# EAGLE design mainControllerRev3 (EAGLE 5.11)
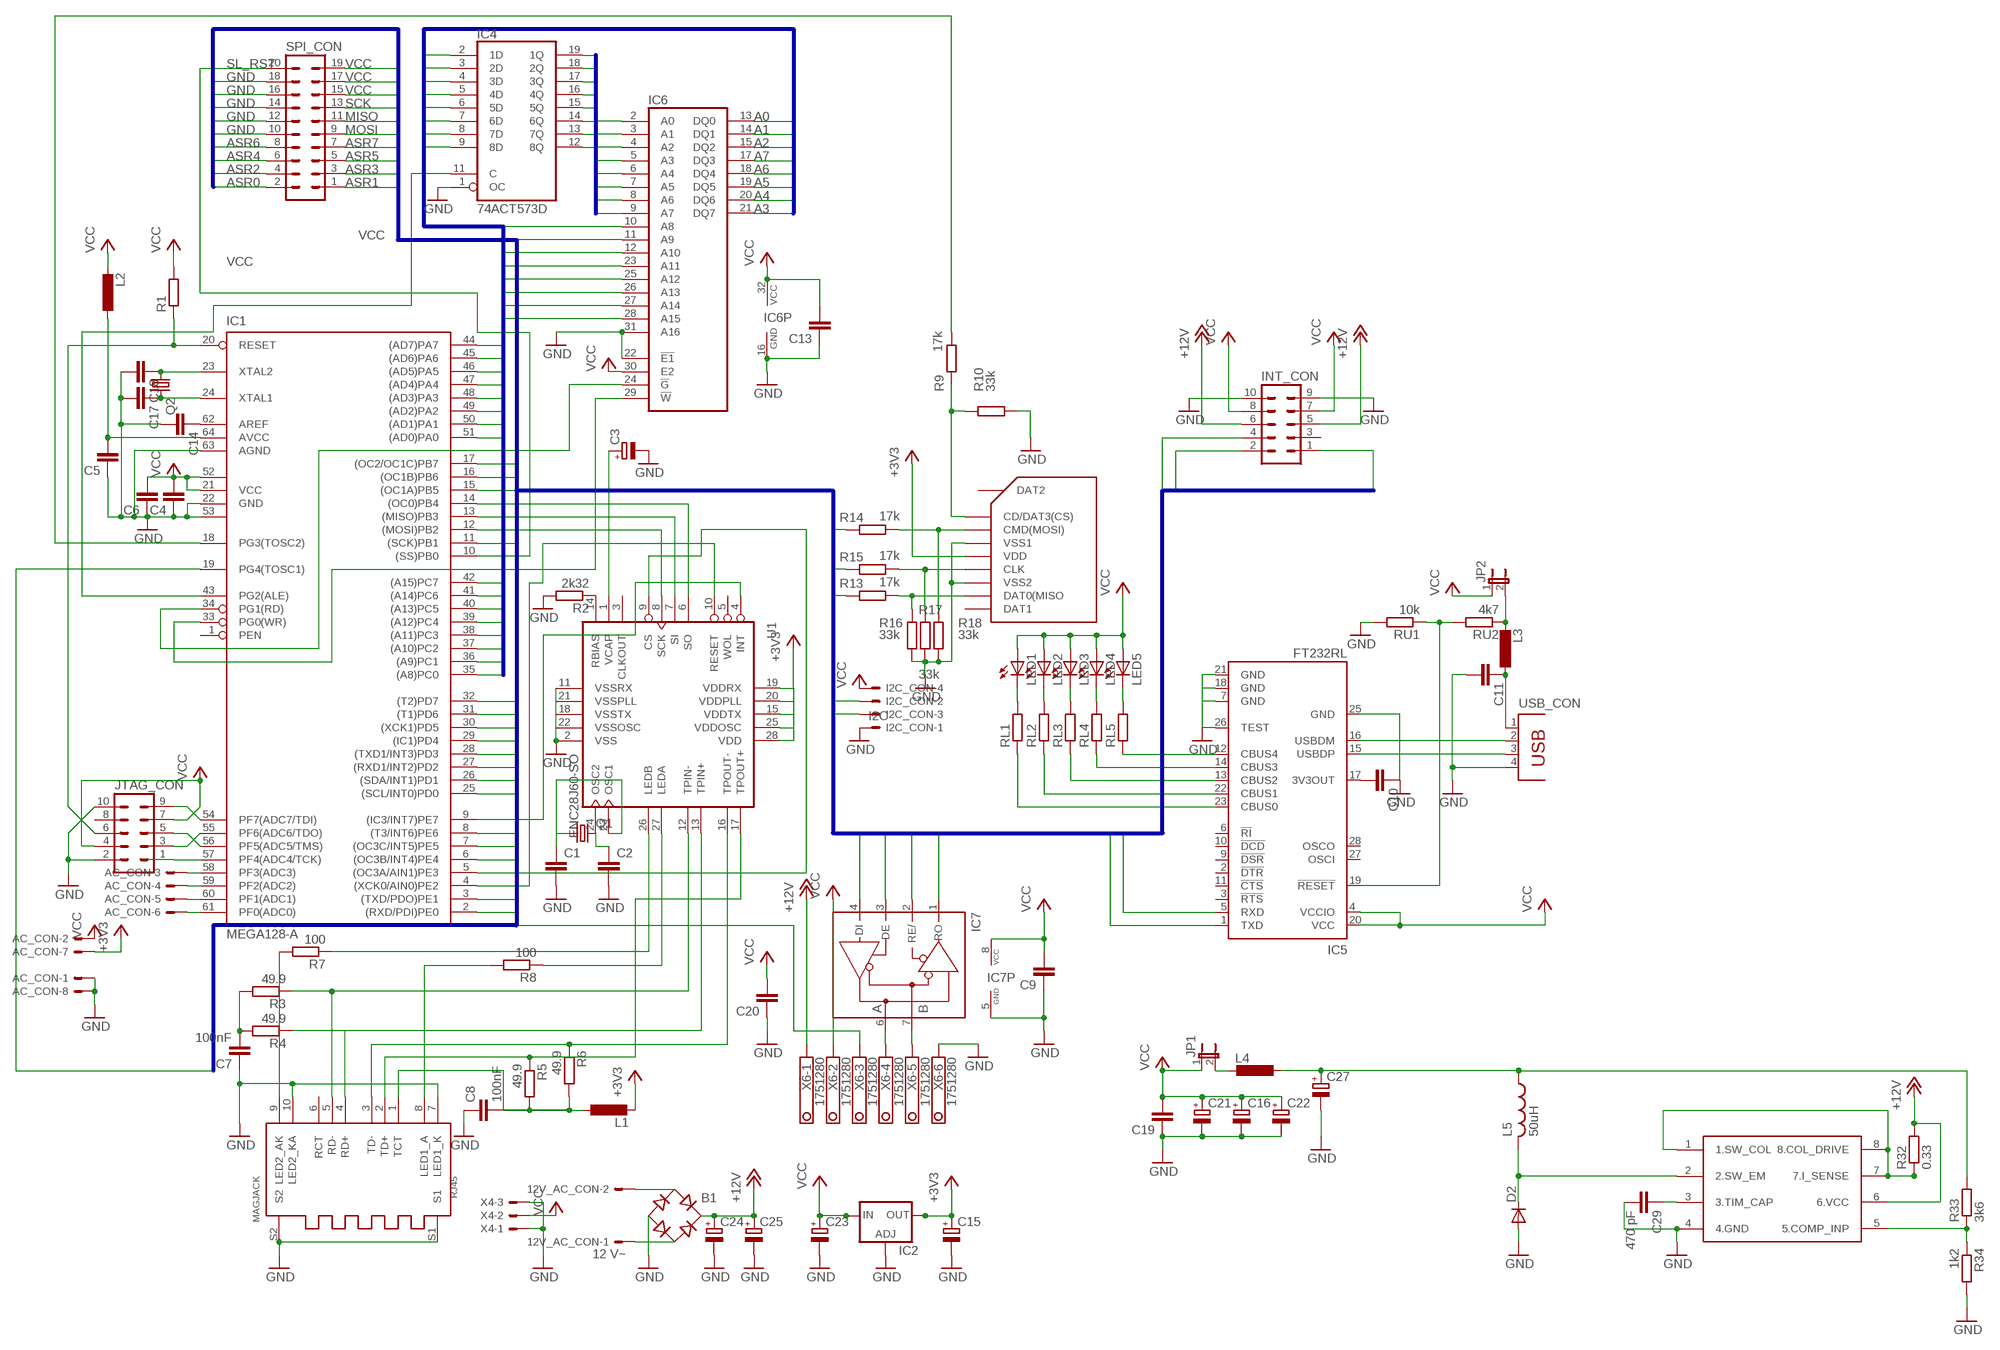
[diagram p0: schematic, sheet 1]

## Parts
12V_AC_CON  12 V~  22-23-2021  [22-23-2021]
AC_CON  22-23-2081  [22-23-2081]
B1  RB1A  [RB1A]
C1  C-EUC0805  [C0805]
C2  C-EUC0805  [C0805]
C3  CPOL-EU153CLV-0605  [153CLV-0605]
C4  C-EUC1206  [C1206]
C5  C-EUC0805  [C0805]
C6  C-EUC0805  [C0805]
C7  100nF  C-EUC0805  [C0805]
C8  100nF  C-EUC0805  [C0805]
C9  C-EUC0805  [C0805]
C10  C-EUC1206  [C1206]
C11  C-EUC0805  [C0805]
C13  C-EUC0805  [C0805]
C14  C-EUC0805  [C0805]
C15  CPOL-EU153CLV-0605  [153CLV-0605]
C16  CPOL-EUE5-10.5  [E5-10,5]
C17  C-EUC0805  [C0805]
C18  C-EUC0805  [C0805]
C19  C-EUC1206  [C1206]
C20  C-EUC0805  [C0805]
C21  CPOL-EU153CLV-0605  [153CLV-0605]
C22  CPOL-EU153CLV-0605  [153CLV-0605]
C23  CPOL-EUE3.5-8  [E3,5-8]
C24  CPOL-EUE2.5-7  [E2,5-7]
C25  CPOL-EUE2.5-7  [E2,5-7]
C27  CPOL-EUE3.5-8  [E3,5-8]
C29  470 pF  C-EUC1206  [C1206]
D2  DIODE-TO220H  [TO220AC]
I2C_CON  I2C  22-23-2041  [22-23-2041]
IC1  MEGA128-A  [TQFP64]
IC2  LM317TL  [317TL]
IC4  74ACT573D  [SO20W]
IC5  FT232RL  [SSOP28]
IC6  MCM6226ASO32X  [SO32X]
IC7  MAX481CSA  [SO08]
INT_CON  ML10  [ML10]
JP1  JP1E  [JP1]
JP2  JP1E  [JP1]
JTAG_CON  ML10  [ML10]
L1  L-EUL3225M  [L3225M]
L2  L-EUL3225M  [L3225M]
L3  L-EUL3225M  [L3225M]
L4  L-EUL3225M  [L3225M]
L5  50uH  L  [CEWKA]
LED1  LS_T679-D2E2-1  [PLCC2]
LED2  LS_T679-D2E2-1  [PLCC2]
LED3  LS_T679-D2E2-1  [PLCC2]
LED4  LS_T679-D2E2-1  [PLCC2]
LED5  LS_T679-D2E2-1  [PLCC2]
Q1  CRYTALHC49S  [HC49/S]
Q2  CRYTALSM49  [SM49]
R1  R-EU_R1206  [R1206]
R2  2k32  R-EU_R1206  [R1206]
R3  49.9  R-EU_R1206  [R1206]
R4  49.9  R-EU_R1206  [R1206]
R5  49.9  R-EU_R1206  [R1206]
R6  49.9  R-EU_R1206  [R1206]
R7  100  R-EU_R1206  [R1206]
R8  100  R-EU_R1206  [R1206]
R9  17k  R-EU_R1206  [R1206]
R10  33k  R-EU_R1206  [R1206]
R13  17k  R-EU_R1206  [R1206]
R14  17k  R-EU_R1206  [R1206]
R15  17k  R-EU_R1206  [R1206]
R16  33k  R-EU_R1206  [R1206]
R17  33k  R-EU_R1206  [R1206]
R18  33k  R-EU_R1206  [R1206]
R32  0.33  R-EU_0204/7  [0204/7]
R33  3k6  R-EU_R1206  [R1206]
R34  1k2  R-EU_R1206  [R1206]
RJ45  MAGJACK  [08B0-1X1T-06-F]
RL1  R-EU_R1206  [R1206]
RL2  R-EU_R1206  [R1206]
RL3  R-EU_R1206  [R1206]
RL4  R-EU_R1206  [R1206]
RL5  R-EU_R1206  [R1206]
RU1  10k  R-EU_R1206  [R1206]
RU2  4k7  R-EU_R1206  [R1206]
SD_CON  SD  [SD_ATTEND]
SPI_CON  ML20  [ML20]
STAB_IMP2  MC34063  [DIL08]
U1  ENC28J60-SO  [SO28W]
USB_CON  PN61729  [PN61729]
X4  22-23-2031  [22-23-2031]
X6  1751280  [1751280]

## Nets
5V_A/C: C5.2 IC1.64(AVCC) L2.1
485EN: IC1.19(PG4(TOSC1)) IC7.2(RE/) IC7.3(DE)
+3V3: AC_CON.7 C15.+ IC2.2(OUT) L1.2 SD_CON.P$4(VDD) U1.15(VDDTX) U1.19(VDDRX) U1.20(VDDPLL) U1.25(VDDOSC) U1.28(VDD)
+12V: B1.+ C24.+ C25.+ INT_CON.5 INT_CON.6 R32.2 STAB_IMP2.6(6.VCC) X6.1
A0: IC1.51((AD0)PA0) IC4.2(1D) IC6.13(DQ0)
A1: IC1.50((AD1)PA1) IC4.3(2D) IC6.14(DQ1)
A2: IC1.49((AD2)PA2) IC4.4(3D) IC6.15(DQ2)
A3: IC1.48((AD3)PA3) IC4.5(4D) IC6.21(DQ7)
A4: IC1.47((AD4)PA4) IC4.6(5D) IC6.20(DQ6)
A5: IC1.46((AD5)PA5) IC4.7(6D) IC6.19(DQ5)
A6: IC1.45((AD6)PA6) IC4.8(7D) IC6.18(DQ4)
A7: IC1.44((AD7)PA7) IC4.9(8D) IC6.17(DQ3)
A8: IC1.35((A8)PC0) IC6.10(A8)
A9: IC1.36((A9)PC1) IC6.11(A9)
A10: IC1.37((A10)PC2) IC6.12(A10)
A11: IC1.38((A11)PC3) IC6.28(A15)
A12: IC1.39((A12)PC4) IC6.27(A14)
A13: IC1.40((A13)PC5) IC6.26(A13)
A14: IC1.41((A14)PC6) IC6.25(A12)
A15: IC1.42((A15)PC7) IC6.23(A11)
AC1_12V: 12V_AC_CON.2 B1.AC1
AC2_12V: 12V_AC_CON.1 B1.AC2
ADC0: AC_CON.6 IC1.61(PF0(ADC0))
ADC1: AC_CON.5 IC1.60(PF1(ADC1))
ADC2: AC_CON.4 IC1.59(PF2(ADC2))
ADC3: AC_CON.3 IC1.58(PF3(ADC3))
ADR0: IC4.19(1Q) IC6.2(A0)
ADR1: IC4.18(2Q) IC6.3(A1)
ADR2: IC4.17(3Q) IC6.4(A2)
ADR3: IC4.16(4Q) IC6.5(A3)
ADR4: IC4.15(5Q) IC6.6(A4)
ADR5: IC4.14(6Q) IC6.7(A5)
ADR6: IC4.13(7Q) IC6.8(A6)
ADR7: IC4.12(8Q) IC6.9(A7)
ALE: IC1.43(PG2(ALE)) IC4.11(C)
ASR0: IC1.29((IC1)PD4) SPI_CON.2
ASR1: IC1.30((XCK1)PD5) SPI_CON.1
ASR2: IC1.31((T1)PD6) SPI_CON.4
ASR3: IC1.32((T2)PD7) SPI_CON.3
ASR4: IC1.14((OC0)PB4) SPI_CON.6
ASR5: IC1.15((OC1A)PB5) SPI_CON.5
ASR6: IC1.16((OC1B)PB6) SPI_CON.8
ASR7: IC1.17((OC2/OC1C)PB7) SPI_CON.7
COMP_INPUT: R33.1 R34.1 STAB_IMP2.5(5.COMP_INP)
CPU_RST: IC1.20(RESET) JTAG_CON.6 R1.1
D_A: IC7.6(A) X6.4
D_B: IC7.7(B) X6.5
ENC_CS: IC1.5((OC3A/AIN1)PE3) U1.9(CS)
GND: AC_CON.1 AC_CON.8 B1.- C1.2 C2.2 C3.- C4.1 C5.1 C6.1 C7.1 C8.1 C9.1 C10.1 C11.2 C13.1 C14.2 C15.- C16.- C17.2 C18.2 C19.1 C20.1 C21.- C22.- C23.- C24.- C25.- C27.- C29.2 D2.A I2C_CON.1 IC1.22(GND) IC1.53(GND1) IC1.63(AGND) IC2.1(ADJ) IC4.1(OC) IC5.7(GND) IC5.18(GND) IC5.21(GND) IC5.25(GND) IC5.26(TEST) IC6.16(GND) IC6.22(!E1) IC6.31(A16) IC7.5(GND) INT_CON.9 INT_CON.10 JTAG_CON.2 JTAG_CON.10 R2.2 R10.1 R16.1 R17.1 R18.1 R34.2 RJ45.7(LED1_K) RJ45.10(LED2_KA) RJ45.S1 RJ45.S2 RU1.2 SD_CON.P$3(VSS1) SD_CON.P$6(VSS2) SPI_CON.10 SPI_CON.12 SPI_CON.14 SPI_CON.16 SPI_CON.18 STAB_IMP2.4(4.GND) U1.2(VSS) U1.11(VSSRX) U1.18(VSSTX) U1.21(VSSPLL) U1.22(VSSOSC) USB_CON.4 X4.1 X4.3 X6.6
INT4: IC1.6((OC3B/INT4)PE4) INT_CON.1
INT5: IC1.7((OC3C/INT5)PE5) INT_CON.2
INT6: IC1.8((T3/INT6)PE6) INT_CON.4 X6.3
MISO: IC1.13((MISO)PB3) R13.1 SPI_CON.11 U1.6(SO)
MOSI: IC1.12((MOSI)PB2) R14.1 SPI_CON.9 U1.7(SI)
N$1: R9.1 R10.2 SD_CON.P$1(CD/DAT3(CS))
N$2: IC1.54(PF7(ADC7/TDI)) JTAG_CON.9
N$3: IC1.56(PF5(ADC5/TMS)) JTAG_CON.5
N$4: C2.1 Q1.2 U1.24(OSC2)
N$5: IC1.55(PF6(ADC6/TDO)) JTAG_CON.3
N$6: IC1.57(PF4(ADC4/TCK)) JTAG_CON.1
N$7: C18.1 IC1.23(XTAL2) Q2.1
N$8: C17.1 IC1.24(XTAL1) Q2.2
N$10: IC1.9((IC3/INT7)PE7) U1.4(INT)
N$13: IC5.16(USBDM) USB_CON.2
N$14: IC5.15(USBDP) USB_CON.3
N$15: C10.2 IC5.17(3V3OUT)
N$18: C1.1 Q1.1 U1.23(OSC1)
N$19: R2.1 U1.14(RBIAS)
N$20: R7.2 RJ45.9(LED2_AK)
N$22: JP1.2 L4.2
N$23: R8.2 RJ45.8(LED1_A)
N$24: R3.1 RJ45.5(RD-) U1.12(TPIN-)
N$25: C11.1 L3.1 USB_CON.1
N$26: JP2.2 L3.2 RU2.1
N$27: R4.1 RJ45.4(RD+) U1.13(TPIN+)
N$28: IC5.19(!RESET) RU1.1 RU2.2
N$29: R6.1 RJ45.3(TD-) U1.16(TPOUT-)
N$30: IC5.12(CBUS4) RL5.1
N$31: R5.1 RJ45.2(TD+) U1.17(TPOUT+)
N$32: C7.2 R3.2 R4.2
N$33: IC1.4((XCK0/AIN0)PE2) U1.10(RESET)
N$34: C3.+ U1.1(VCAP)
N$35: C8.2 L1.1 R5.2 R6.2 RJ45.1(TCT)
N$36: R7.1 U1.26(LEDB)
N$37: R8.1 U1.27(LEDA)
N$38: IC5.14(CBUS3) RL4.1
N$39: IC5.13(CBUS2) RL3.1
N$40: IC5.22(CBUS1) RL2.1
N$41: IC5.23(CBUS0) RL1.1
N$45: C14.1 IC1.62(AREF)
N$48: LED5.C RL5.2
N$49: LED4.C RL4.2
N$50: LED3.C RL3.2
N$51: LED2.C RL2.2
N$52: LED1.C RL1.2
N$59: D2.C L5.P$2 STAB_IMP2.2(2.SW_EM)
N$63: C27.+ L4.1 L5.P$1 R33.2
N$66: C29.1 STAB_IMP2.3(3.TIM_CAP)
N$68: R32.1 STAB_IMP2.1(1.SW_COL) STAB_IMP2.7(7.I_SENSE) STAB_IMP2.8(8.COL_DRIVE)
RD: IC1.34(PG1(RD)) IC6.24(!G)
RX0: IC1.2((RXD/PDI)PE0) IC7.1(RO)
RX1: IC1.27((RXD1/INT2)PD2) IC5.1(TXD)
SCK: IC1.11((SCK)PB1) R15.1 SPI_CON.13 U1.8(SCK)
SCL: I2C_CON.2 IC1.25((SCL/INT0)PD0)
SD_CLK: R15.2 R17.2 SD_CON.P$5(CLK)
SD_CS: IC1.18(PG3(TOSC2)) R9.2
SD_MISO: R13.2 R16.2 SD_CON.P$7(DAT0(MISO)
SD_MOSI: R14.2 R18.2 SD_CON.P$2(CMD(MOSI))
SDA: I2C_CON.3 IC1.26((SDA/INT1)PD1)
SL_RST: IC1.10((SS)PB0) SPI_CON.20
TX0: IC1.3((TXD/PDO)PE1) IC7.4(DI)
TX1: IC1.28((TXD1/INT3)PD3) IC5.5(RXD)
VCC: AC_CON.2 C4.2 C6.2 C9.2 C13.2 C16.+ C19.2 C20.2 C21.+ C22.+ C23.+ I2C_CON.4 IC1.21(VCC) IC1.52(VCC1) IC2.3(IN) IC5.4(VCCIO) IC5.20(VCC) IC6.30(E2) IC6.32(VCC) IC7.8(VCC) INT_CON.7 INT_CON.8 JP1.1 JP2.1 JTAG_CON.4 JTAG_CON.7 L2.2 LED1.A LED2.A LED3.A LED4.A LED5.A R1.2 SPI_CON.15 SPI_CON.17 SPI_CON.19 X4.2 X6.2
WR: IC1.33(PG0(WR)) IC6.29(!W)
Unconnected: IC1.1(PEN) IC5.2(!DTR) IC5.3(!RTS) IC5.6(!RI) IC5.9(!DSR) IC5.10(!DCD) IC5.11(!CTS) IC5.27(OSCI) IC5.28(OSCO) INT_CON.3 JTAG_CON.8 RJ45.6(RCT) SD_CON.P$8(DAT1) SD_CON.P$9(DAT2) U1.3(CLKOUT) U1.5(WOL)

## Buses
GND,VCC,ASR[0..7],MISO,MOSI,SCK,TX0,RX0,TX1,RX1,INT[4..6],SDA,SCL,485EN
A[0..15]
ADR[0..7]

## Power pins joined to a net without a drawn wire
GND: IC4.10(GND)
VCC: IC4.20(VCC)

## Library data of the parts
12V_AC_CON = con-molex:22-23-2021: .100" (2.54mm) Center Header - 2 Pin
AC_CON = con-molex:22-23-2081: .100" (2.54mm) Center Header - 8 Pin
B1 = rectifier:RB1A: RECTIFIER 1 A
C1 C2 C4-C11 C13 C14 C17-C20 C29 = rcl:C-EU: CAPACITOR, European symbol
C3 C15 C16 C21-C25 C27 = rcl:CPOL-EU: POLARIZED CAPACITOR, European symbol
D2 = diode:DIODE-: DIODE
I2C_CON = con-molex:22-23-2041: .100" (2.54mm) Center Header - 4 Pin
IC1 = atmel:MEGA128: MICROCONTROLLER 128 Kbytes FLASH 4 Kbytes SRAM 4 Kbytes EEPROM DUAL USART 8-channel 10 bit ADC Source: avr.lbr
IC2 = v-reg:LM317TL: VOLTAGE REGULATOR
IC4 = 74xx-eu:74*573: 8-bit D latch BUS DRIVER
IC5 = ftdichip:FT232R: Source: http://www.ftdichip.com/Documents/DataSheets/DS_FT232R_v104.pdf
IC6 = moje:MCM6226A: MEMORY
IC7 = maxim:MAX481CSA: RS485 TRANSEIVER
INT_CON JTAG_CON = con-harting-ml:ML10: HARTING
JP1 JP2 = jumper:JP1E: JUMPER
L1-L4 = rcl:L-EU: INDUCTOR, European symbol
L5 = elementy:L
LED1-LED5 = led:*_T679-?-1: LC TOPLED® Low Current LED Source: http://catalog.osram-os.com .. LG_LS_LY_T679_OBS.pdf; COLOR: super-red
Q1 Q2 = crystal:CRYTAL: CRYSTAL
R1-R10 R13-R18 R32-R34 RL1-RL5 RU1 RU2 = rcl:R-EU_: RESISTOR, European symbol
RJ45 = elementy:MAGJACK: Magjack RJ45: 08B0-1X1T-06-F mcgregor@blackmesaeast.com.pl
SD_CON = elementy:SD
SPI_CON = con-harting-ml:ML20: HARTING
STAB_IMP2 = elementy:MC34063
U1 = elementy:ENC28J60-*: Microchip 10Mbit Eth. contoller with SPI interface
USB_CON = con-berg:PN61729: BERG USB connector
X4 = con-molex:22-23-2031: .100" (2.54mm) Center Header - 3 Pin
X6 = con-phoenix-350:1751280: MKDS 1/ 6-3,5 Printklemme Nennstrom: 10 A Bemessungsspannung: 160 V Raster: 3,5 mm Polzahl: 6 Montageart: Löten Anschlussart: Schraubanschluss Anschlussrichtung vom Leiter zur Platine: 0° Source: http://eshop.phoenixcontact.com .. 1751280.pdf

## Board
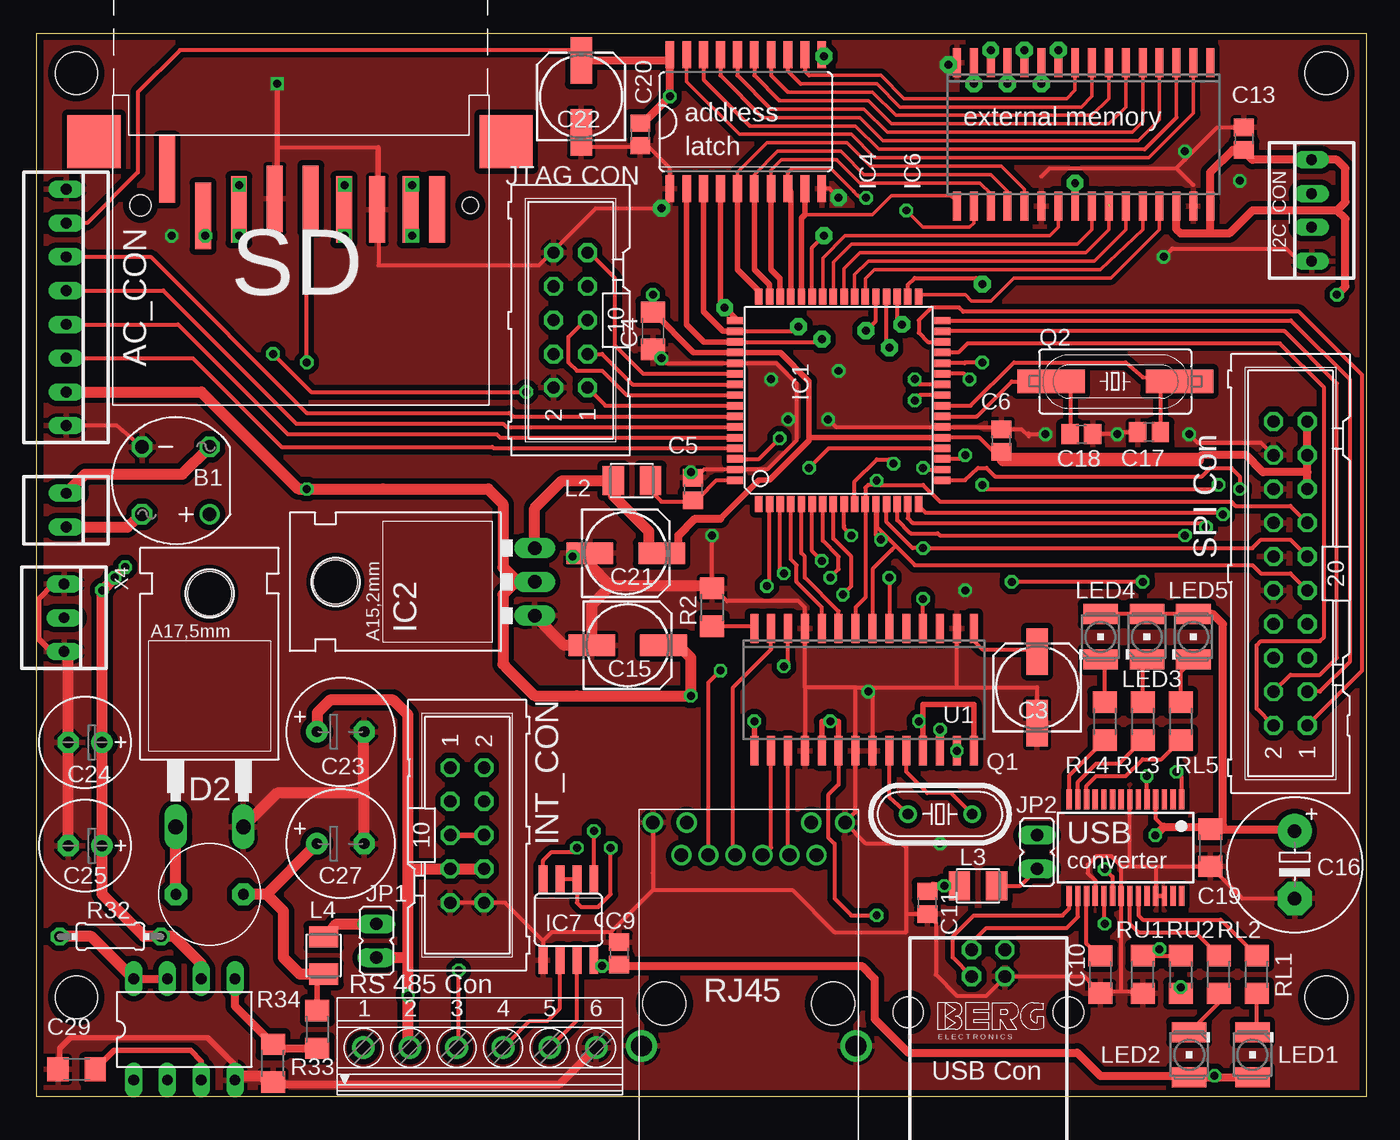
[diagram p1: board, top side]
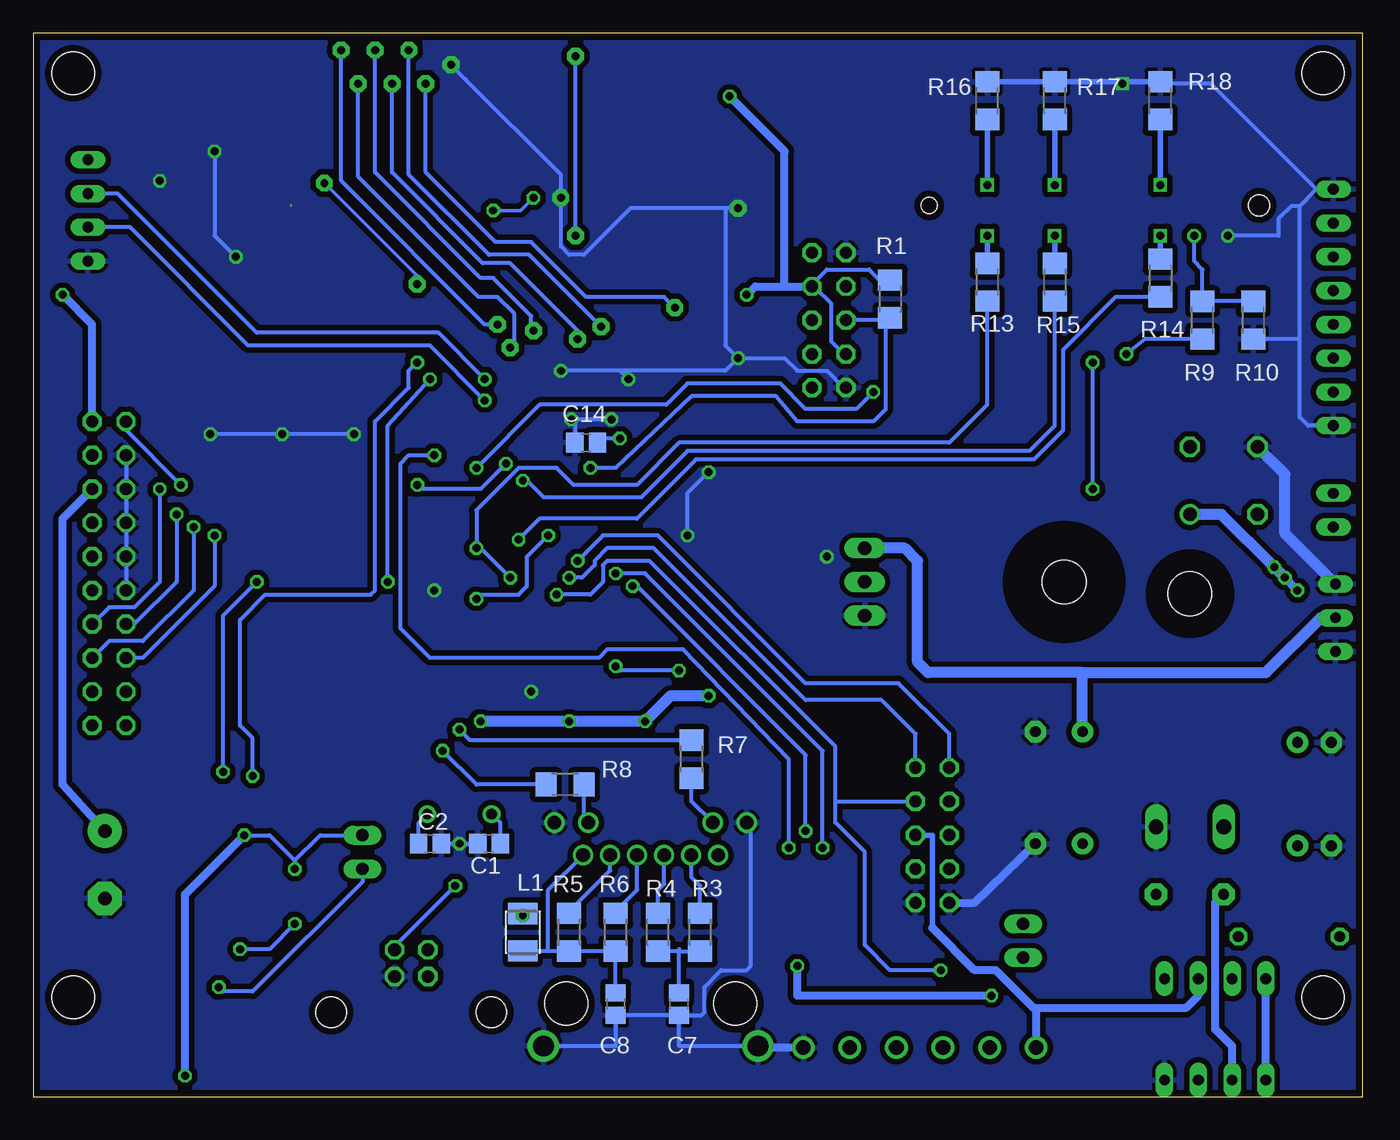
[diagram p2: board, bottom side, seen from below]

Size 100 x 80 mm. Coordinates in mm from the lower left corner, seen from the top.
Outline: 0,0 0,80 100,80 100,0 0,0
Copper layers (1*16): Top 0.035mm / dielectric 1.5mm / Bottom 0.035mm
Design rules "moje": minimum track width 10mil, minimum drill 18mil, track to track 8mil, track to pad 8mil, pad to pad 8mil, via to via 8mil, smd to smd 0mil, copper to edge 20mil, drill to drill 8mil, minimum pad ring 10mil, minimum via ring 8mil, stop-mask expansion 4mil, vias tented up to drill 0mil, thermal gap 10mil
Holes 3.2 mm at 3,7.5 97,7.5 97,77 3,77

### Footprints (pad centres in the part's own frame; a part is rotated, then mirrored left to right if it is on the bottom)
22-23-2021 = drill 0.813 long: 1 -1.27,0; 2 1.27,0
22-23-2081 = drill 0.813 long: 1 -8.89,0; 2 -6.35,0; 3 -3.81,0; 4 -1.27,0; 5 1.27,0; 6 3.81,0; 7 6.35,0; 8 8.89,0
RB1A = drill 1.016 round: + -2.54,2.54 | drill 1.016 octagon: - 2.54,-2.54; AC1 2.54,2.54; AC2 -2.54,-2.54
C0805 = smd 1.3 x 1.5: 1 -0.85,0; 2 0.85,0
153CLV-0605 = smd 3.5 x 1.6: + 2.7,0; - -2.7,0
C1206 = smd 1.6 x 1.8: 1 -1.4,0; 2 1.4,0
E5-10,5 = drill 1.016 pad 2.54 round: + -2.54,0 | drill 1.016 pad 2.54 octagon: - 2.54,0
E3,5-8 = drill 0.813 pad 1.6 round: + -1.778,0 | drill 0.813 pad 1.6 octagon: - 1.778,0
E2,5-7 = drill 0.813 pad 1.6 round: + -1.27,0 | drill 0.813 pad 1.6 octagon: - 1.27,0
TO220AC = drill 1.118 long: A 2.54,-6.35; C -2.54,-6.35 | hole 3.302: 0,11.176
22-23-2041 = drill 0.813 long: 1 -3.81,0; 2 -1.27,0; 3 1.27,0; 4 3.81,0
TQFP64 = smd 1.194 x 0.559: 1 -7.8,6; 2 -7.8,5.2; 3 -7.8,4.4; 4 -7.8,3.6; 5 -7.8,2.8; 6 -7.8,2; 7 -7.8,1.2; 8 -7.8,0.4; 9 -7.8,-0.4; 10 -7.8,-1.2; 11 -7.8,-2; 12 -7.8,-2.8; 13 -7.8,-3.6; 14 -7.8,-4.4; 15 -7.8,-5.2; 16 -7.8,-6; 33 7.8,-6; 34 7.8,-5.2; 35 7.8,-4.4; 36 7.8,-3.6; 37 7.8,-2.8; 38 7.8,-2; 39 7.8,-1.2; 40 7.8,-0.4; 41 7.8,0.4; 42 7.8,1.2; 43 7.8,2; 44 7.8,2.8; 45 7.8,3.6; 46 7.8,4.4; 47 7.8,5.2; 48 7.8,6 | smd 0.559 x 1.194: 17 -6,-7.8; 18 -5.2,-7.8; 19 -4.4,-7.8; 20 -3.6,-7.8; 21 -2.8,-7.8; 22 -2,-7.8; 23 -1.2,-7.8; 24 -0.4,-7.8; 25 0.4,-7.8; 26 1.2,-7.8; 27 2,-7.8; 28 2.8,-7.8; 29 3.6,-7.8; 30 4.4,-7.8; 31 5.2,-7.8; 32 6,-7.8; 49 6,7.8; 50 5.2,7.8; 51 4.4,7.8; 52 3.6,7.8; 53 2.8,7.8; 54 2,7.8; 55 1.2,7.8; 56 0.4,7.8; 57 -0.4,7.8; 58 -1.2,7.8; 59 -2,7.8; 60 -2.8,7.8; 61 -3.6,7.8; 62 -4.4,7.8; 63 -5.2,7.8; 64 -6,7.8
317TL = drill 1.016 long: 1 -2.54,-3.81; 2 0,-3.81; 3 2.54,-3.81 | hole 3.302: 0,11.176
SO20W = smd 0.66 x 2.032: 1 -5.715,-5.029; 2 -4.445,-5.029; 3 -3.175,-5.029; 4 -1.905,-5.029; 5 -0.635,-5.029; 6 0.635,-5.029; 7 1.905,-5.029; 8 3.175,-5.029; 9 4.445,-5.029; 10 5.715,-5.029; 11 5.715,5.029; 12 4.445,5.029; 13 3.175,5.029; 14 1.905,5.029; 15 0.635,5.029; 16 -0.635,5.029; 17 -1.905,5.029; 18 -3.175,5.029; 19 -4.445,5.029; 20 -5.715,5.029
SSOP28 = smd 0.4 x 1.5: 1 -4.225,-3.625; 2 -3.575,-3.625; 3 -2.925,-3.625; 4 -2.275,-3.625; 5 -1.625,-3.625; 6 -0.975,-3.625; 7 -0.325,-3.625; 8 0.325,-3.625; 9 0.975,-3.625; 10 1.625,-3.625; 11 2.275,-3.625; 12 2.925,-3.625; 13 3.575,-3.625; 14 4.225,-3.625; 15 4.225,3.625; 16 3.575,3.625; 17 2.925,3.625; 18 2.275,3.625; 19 1.625,3.625; 20 0.975,3.625; 21 0.325,3.625; 22 -0.325,3.625; 23 -0.975,3.625; 24 -1.625,3.625; 25 -2.275,3.625; 26 -2.925,3.625; 27 -3.575,3.625; 28 -4.225,3.625
SO32X = smd 0.6 x 2.2: 1 -9.525,-5.4; 2 -8.255,-5.4; 3 -6.985,-5.4; 4 -5.715,-5.4; 5 -4.445,-5.4; 6 -3.175,-5.4; 7 -1.905,-5.4; 8 -0.635,-5.4; 9 0.635,-5.4; 10 1.905,-5.4; 11 3.175,-5.4; 12 4.445,-5.4; 13 5.715,-5.4; 14 6.985,-5.4; 15 8.255,-5.4; 16 9.525,-5.4; 17 9.525,5.4; 18 8.255,5.4; 19 6.985,5.4; 20 5.715,5.4; 21 4.445,5.4; 22 3.175,5.4; 23 1.905,5.4; 24 0.635,5.4; 25 -0.635,5.4; 26 -1.905,5.4; 27 -3.175,5.4; 28 -4.445,5.4; 29 -5.715,5.4; 30 -6.985,5.4; 31 -8.255,5.4; 32 -9.525,5.4
SO08 = smd 0.66 x 2.032: 1 -1.905,-3.073; 2 -0.635,-3.073; 3 0.635,-3.073; 4 1.905,-3.073; 5 1.905,3.073; 6 0.635,3.073; 7 -0.635,3.073; 8 -1.905,3.073
ML10 = drill 0.914 octagon: 1 -5.08,-1.27; 2 -5.08,1.27; 3 -2.54,-1.27; 4 -2.54,1.27; 5 0,-1.27; 6 0,1.27; 7 2.54,-1.27; 8 2.54,1.27; 9 5.08,-1.27; 10 5.08,1.27
JP1 = drill 0.914 long: 1 0,-1.27; 2 0,1.27
L3225M = smd 1.6 x 2.2: 1 -1.4,0; 2 1.4,0
CEWKA = drill 0.8 pad 1.676 octagon: P$1 -2.54,0; P$2 2.54,0
PLCC2 = smd 2.6 x 1.5: A 0,1.7; C 0,-1.7
HC49/S = drill 0.813 round: 1 -2.413,0; 2 2.413,0
SM49 = smd 5.08 x 1.778: 1 -4.826,0; 2 4.826,0
R1206 = smd 1.6 x 1.803: 1 -1.422,0; 2 1.422,0
0204/7 = drill 0.813 octagon: 1 -3.81,0; 2 3.81,0
08B0-1X1T-06-F = drill 1.02 round: 1 2.15,2.46; 2 4.18,2.46; 3 6.21,2.46; 4 8.24,2.46; 5 10.27,2.46; 6 12.3,2.46; 7 0,0; 8 2.54,0; 9 11.91,0; 10 14.45,0 | drill 1.57 round: S1 -0.83,16.808; S2 15.3,16.809 | hole 3.25: 0.88,13.63; 13.58,13.63
SD_ATTEND = smd 1.2 x 5: P$1 7.8,3.6; P$2 5.1,3.1; P$3 2.4,2.3; P$4 -0.3,2.3; P$5 -2.8,3.1; P$6 -5.3,3.1; P$7 -7.8,3.1; P$8 -9.8,3.1; P$9 10.5,0.1 | smd 4 x 4: P$10 -15,-2; P$11 16,-2 | hole 1.6: 12.5,2.8 | hole 1.2: -12.3,2.8
ML20 = drill 0.914 octagon: 1 -11.43,-1.27; 2 -11.43,1.27; 3 -8.89,-1.27; 4 -8.89,1.27; 5 -6.35,-1.27; 6 -6.35,1.27; 7 -3.81,-1.27; 8 -3.81,1.27; 9 -1.27,-1.27; 10 -1.27,1.27; 11 1.27,-1.27; 12 1.27,1.27; 13 3.81,-1.27; 14 3.81,1.27; 15 6.35,-1.27; 16 6.35,1.27; 17 8.89,-1.27; 18 8.89,1.27; 19 11.43,-1.27; 20 11.43,1.27
DIL08 = drill 0.813 long: 1 -3.81,-3.81; 2 -1.27,-3.81; 3 1.27,-3.81; 4 3.81,-3.81; 5 3.81,3.81; 6 1.27,3.81; 7 -1.27,3.81; 8 -3.81,3.81
SO28W = smd 0.6 x 2.2: 1 -8.255,-4.6; 2 -6.985,-4.6; 3 -5.715,-4.6; 4 -4.445,-4.6; 5 -3.175,-4.6; 6 -1.905,-4.6; 7 -0.635,-4.6; 8 0.635,-4.6; 9 1.905,-4.6; 10 3.175,-4.6; 11 4.445,-4.6; 12 5.715,-4.6; 13 6.985,-4.6; 14 8.255,-4.6; 15 8.255,4.6; 16 6.985,4.6; 17 5.715,4.6; 18 4.445,4.6; 19 3.175,4.6; 20 1.905,4.6; 21 0.635,4.6; 22 -0.635,4.6; 23 -1.905,4.6; 24 -3.175,4.6; 25 -4.445,4.6; 26 -5.715,4.6; 27 -6.985,4.6; 28 -8.255,4.6
PN61729 = drill 0.95 octagon: 1 1.25,4.71; 2 -1.25,4.71; 3 -1.25,2.71; 4 1.25,2.71 | hole 2.3: -6.02,0; 6.02,0
22-23-2031 = drill 0.813 long: 1 -2.54,0; 2 0,0; 3 2.54,0
1751280 = drill 1.1 pad 1.7 round: 1 -8.75,-0.1; 2 -5.25,-0.1; 3 -1.75,-0.1; 4 1.75,-0.1; 5 5.25,-0.1; 6 8.75,-0.1

### Placement (x,y rotation side)
12V_AC_CON  2.22,44.13 270 top
AC_CON  2.22,59.37 270 top
B1  10.48,46.35 180 top
C1  65.72,19.05 180 bottom
C2  70.17,19.05 0 bottom
C3  75.25,30.8 90 top
C4  46.35,57.63 90 top
C5  49.37,45.72 270 top
C6  72.55,49.37 270 top
C7  51.44,6.99 90 bottom
C8  56.2,6.99 90 bottom
C9  43.81,10.79 270 top
C10  80.01,9.21 90 top
C11  66.99,14.61 270 top
C13  90.81,72.07 270 top
C14  58.42,49.21 180 bottom
C15  44.45,33.97 0 top
C16  94.61,17.46 270 top
C17  83.66,50.01 180 top
C18  78.58,49.85 0 top
C19  88.27,18.73 90 top
C20  45.4,72.39 90 top
C21  44.31,40.9 0 top
C22  40.96,75.25 90 top
C23  22.86,27.46 0 top
C24  3.65,26.67 180 top
C25  3.65,18.89 180 top
C27  22.86,19.05 0 top
C29  3.02,2.06 180 top
D2  13.02,26.67 0 top
I2C_CON  95.89,66.67 90 top
IC1  60.33,52.39 90 top
IC2  33.66,38.73 90 top
IC4  53.34,73.34 0 top
IC5  81.89,18.75 180 top
IC6  78.74,72.39 180 top
IC7  40.01,13.34 180 top
INT_CON  32.38,19.68 270 top
JP1  25.56,11.75 0 top
JP2  75.25,18.41 180 top
JTAG_CON  40.16,58.42 90 top
L1  63.18,12.38 90 bottom
L2  44.77,46.35 180 top
L3  70.8,15.88 0 top
L4  21.59,10.64 90 top
L5  13.02,15.24 180 top
LED1  91.44,3.17 180 top
LED2  86.68,3.17 180 top
LED3  83.5,34.61 0 top
LED4  80.01,34.61 0 top
LED5  87,34.61 0 top
Q1  67.94,21.27 0 top
Q2  81.12,53.82 0 top
R1  35.56,60.01 90 bottom
R2  50.8,36.83 90 top
R3  49.85,12.38 270 bottom
R4  53.02,12.38 270 bottom
R5  59.69,12.38 270 bottom
R6  56.2,12.38 270 bottom
R7  50.48,25.4 270 bottom
R8  60.01,23.5 0 bottom
R9  12.06,58.42 270 bottom
R10  8.26,58.42 90 bottom
R13  28.26,61.28 90 bottom
R14  15.24,61.59 90 bottom
R15  23.18,61.28 90 bottom
R16  28.26,74.93 270 bottom
R17  23.18,74.93 270 bottom
R18  15.24,74.93 270 bottom
R32  5.56,12.07 0 top
R33  21.11,5.08 90 top
R34  17.78,2.54 270 top
RJ45  60.8,20.64 180 top
RL1  91.76,9.21 270 top
RL2  88.9,9.21 270 top
RL3  83.19,28.26 90 top
RL4  80.33,28.26 90 top
RL5  86.04,28.26 90 top
RU1  83.19,9.21 270 top
RU2  86.04,9.21 90 top
SD_CON  20.32,69.85 180 top
SPI_CON  94.3,39.37 90 top
STAB_IMP2  11.11,5.08 0 top
U1  62.23,30.64 180 top
USB_CON  71.57,6.35 0 top
X4  2.06,36.04 270 top
X6  33.34,3.81 0 top

### Tracks (layer width: path | path; a pad name or v marks a point on that pad's centre or on a via)
5V_A/C
  Top 0.305: IC1.64 51.15,46.39 49.85,45.09 49.53,45.09 49.37,44.93 C5.2 49.31,44.87 49.21,44.77 46.99,44.77 46.17,45.59 L2.1
485EN  (via drill 0.6)
  Top 0.305: IC1.19 69.58,47.99 v69.85,48.26 | IC7.3 IC7.2 40.64,14.61 40.96,14.29 42.23,14.29 43.18,15.24 v43.18,18.73
  Bottom 0.305: v69.85,48.26 71.75,48.26 72.39,47.62 72.39,35.24 70.17,33.02 57.47,33.02 56.83,33.66 51.12,33.66 43.18,25.4 v43.18,18.73
+3V3  (via drill 0.6)
  Top 0.305: U1.15 | U1.20 60.33,23.5 59.53,22.7 59.53,19.53 60.01,19.05 60.01,14.92 61.28,13.65 v63.18,13.65 | SD_CON.P$4 20.62,67.33 20.95,66.99 20.95,65.72 20.32,65.09 v20.32,55.24 | 48.26,33.97 C15.+
  Top 0.406: v53.98,28.26 U1.15 | U1.19 59.05,28.26 v59.69,28.26 60.33,28.26 U1.20 | U1.25 | v66.36,28.26 66.67,28.26 U1.25 | U1.25 66.67,29.53 70.48,29.53 U1.28 | 35.24,32.38 | 35.08,32.54 35.24,32.38 | IC2.2 36.04,38.73
  Top 0.813: 48.26,33.97 49.21,33.02 v49.21,30.16 40.64,30.16 37.47,30.16 35.24,32.38 | AC_CON.7 12.38,53.02 19.68,45.72 v20.32,45.72 26.04,45.72 33.97,45.72 35.08,44.61 35.08,39.85 36.2,38.73 IC2.2 | 35.08,32.54 35.08,37.78 36.04,38.73
  Bottom 0.305: 63.18,13.97 L1.2 v63.18,13.65 | v20.32,45.72 v20.32,55.24
  Bottom 0.813: v66.36,28.26 v59.69,28.26 v53.98,28.26 52.07,30.16 v49.21,30.16
+12V  (via drill 0.6)
  Top 0.406: INT_CON.6 INT_CON.5
  Top 0.61: v5.87,39.05 | v5.87,39.05 v6.67,39.85 | R32.2
  Top 0.813: STAB_IMP2.6 12.38,10 10.32,12.06 R32.2 8.1,12.06 4.92,15.24 C25.+ C24.+ v4.92,38.1 v5.87,39.05
  Bottom 0.406: 32.38,12.7 32.38,19.68 INT_CON.6 | 24.77,6.67 24.59,6.49 | 10.64,43.81 | v6.67,39.85
  Bottom 0.61: 32.38,12.7 29.21,9.53 27.62,9.53 24.77,6.67 13.34,6.67 12.38,7.62 STAB_IMP2.6 | 24.59,6.49 X6.1 | v4.92,38.1 v5.87,39.05
  Bottom 0.813: B1.+ 10.64,43.81 v6.67,39.85 v5.87,39.05
A0  (via drill 0.6 pad 1.27)
  Top 0.254: v73.03,76.2 IC6.13
  Top 0.305: IC1.51 58.85,56.79 v59.05,56.99
  Top 0.406: IC1.51 50.21,56.79 48.9,58.1 IC4.2
  Bottom 0.305: v73.03,76.2 73.03,69.53 66.2,62.71 64.14,62.71 59.05,57.63 v59.05,56.99
A1  (via drill 0.6 pad 1.27)
  Top 0.254: v71.75,78.74 IC6.14
  Top 0.305: IC1.50 56.95,57.59 v57.31,57.94
  Top 0.406: IC1.50 51.63,57.59 50.16,59.05 IC4.3
  Bottom 0.305: v71.75,78.74 71.75,69.37 65.72,63.34 62.71,63.34 v57.31,57.94
A2  (via drill 0.6 pad 1.27)
  Top 0.254: v70.48,76.2 IC6.15
  Top 0.406: IC1.49 52.52,58.6 v51.75,59.37 51.44,59.69 IC4.4
  Bottom 0.305: v51.75,59.37 52.55,60.17 58.42,60.17 62.55,64.29 65.25,64.29 70.48,69.53 v70.48,76.2
A3
  Top 0.254: IC4.5 52.7,69.53 54.93,71.75 60.96,71.75 62.71,70.01 72.55,70.01 74.3,68.26 IC6.21
  Top 0.406: IC1.48 54.33,60.61 52.7,62.23 IC4.5
A4
  Top 0.254: 53.98,68.26 53.98,69.37 55.72,71.12 60.48,71.12 60.64,70.96 62.23,69.37 71.75,69.37 73.03,68.1 IC6.20
  Top 0.406: IC1.47 55.12,61.08 53.98,62.23 53.98,68.26 IC4.6
A5
  Top 0.254: 55.24,68.26 55.24,69.69 56.04,70.48 60.17,70.48 61.91,68.74 70.96,68.74 71.75,67.94 IC6.19
  Top 0.305: 60.17,70.48
  Top 0.406: IC1.46 55.92,61.55 55.24,62.23 55.24,68.26 IC4.7
A6  (via drill 0.6)
  Top 0.254: 56.83,69.85 59.69,69.85 61.44,68.1 61.75,67.79 61.91,67.63 v62.39,67.63 | 70.48,67.79 IC6.18 70.48,65.72 70.17,65.41 66.67,65.41 v65.41,66.67
  Top 0.305: 56.83,69.85 56.52,69.53 IC4.8 | 61.44,68.1 | 61.75,67.79
  Top 0.406: IC4.8 56.52,68.26 56.73,68.05 IC1.45
  Bottom 0.254: v62.39,67.63 63.34,66.67 v65.41,66.67
A7
  Top 0.254: 57.78,66.36 62.87,66.36 64.29,67.79 68.74,67.79 69.06,67.47 | IC6.17 69.22,66.52 69.06,66.36
  Top 0.305: 69.27,66.41 69.22,66.36 69.06,66.36 69.06,67.47
  Top 0.406: IC1.44 57.52,66.1 57.78,66.36 IC4.9
A8  (via drill 0.6 pad 1.27)
  Top 0.254: v76.83,78.74 IC6.10
  Top 0.305: IC1.35 64.72,58.47 v65.09,58.1
  Bottom 0.305: v65.09,58.1 66.04,58.1 76.83,68.9 v76.83,78.74
A9  (via drill 0.6 pad 1.27)
  Top 0.254: v75.56,76.2 IC6.11
  Top 0.305: IC1.36 63.92,56.57 v64.14,56.36
  Bottom 0.305: v64.14,56.36 63.82,56.67 63.82,58.9 65.09,60.17 66.52,60.17 75.56,69.22 v75.56,76.2
A10  (via drill 0.6 pad 1.27)
  Top 0.254: v74.3,78.74 IC6.12
  Top 0.305: IC1.37 63.12,58.36 v62.39,57.63
  Bottom 0.305: v74.3,78.74 74.3,69.53 66.36,61.59 65.41,61.59 62.55,58.74 62.55,57.78 v62.39,57.63
A11
  Top 0.254: IC1.38 62.33,61.53 63.02,62.23 73.34,62.23 80.01,62.23 83.19,65.25 IC6.28
A12
  Top 0.254: IC1.39 61.52,61.84 62.55,62.87 73.18,62.87 | 73.18,62.87 | 73.18,62.87 79.53,62.87 81.92,65.25 IC6.27
A13  (1 unrouted)
  Top 0.254: IC1.40 60.73,62.31 61.91,63.5 78.9,63.5 80.64,65.25 80.64,67.15
  Top 0.305: 80.54,67.36 80.49,67.31 80.64,67.15
A14
  Top 0.254: IC1.41 59.92,62.78 61.28,64.14 78.26,64.14 79.38,65.25 IC6.25
A15
  Top 0.254: IC1.42 59.12,63.09 60.8,64.77 76.2,64.77 76.83,65.41 IC6.23
AC1_12V
  Top 0.813: 12V_AC_CON.2 6.83,42.86 B1.AC1
AC2_12V
  Top 0.813: 12V_AC_CON.1 3.65,46.83 10.95,46.83 B1.AC2
ADC0
  Top 0.305: IC1.61 34.4,48.79 34.29,48.9 18.41,48.9 11.75,55.56 AC_CON.6
ADC1
  Top 0.305: IC1.60 34.87,49.59 34.61,49.85 18.89,49.85 10.64,58.1 AC_CON.5
ADC2
  Top 0.305: IC1.59 35.34,50.39 35.08,50.64 19.53,50.64 9.53,60.64 AC_CON.4
ADC3
  Top 0.305: IC1.58 35.81,51.19 35.56,51.44 20.32,51.44 8.57,63.18 AC_CON.3
ADR0
  Top 0.254: IC4.19 48.9,76.36 52.86,72.39 61.28,72.39 63.02,70.64 83.66,70.64 87,73.98 IC6.2
ADR1
  Top 0.254: 85.72,73.66 IC6.3 | 53.66,73.03 61.59,73.03 63.34,71.28 83.34,71.28
  Top 0.305: IC4.18 50.16,76.52 53.66,73.03 | 83.34,71.28 85.72,73.66
ADR2
  Top 0.254: 54.61,73.66 61.91,73.66 63.66,71.91 82.87,71.91 84.45,73.5 IC6.4
  Top 0.305: IC4.17 51.44,76.83 54.61,73.66
ADR3
  Top 0.254: 55.24,74.3 62.23,74.3 63.98,72.55 82.39,72.55 83.19,73.34 IC6.5
  Top 0.305: IC4.16 52.7,76.83 55.24,74.3
ADR4
  Top 0.254: 55.88,74.93 62.55,74.93 64.29,73.18 80.64,73.18 81.92,74.45 IC6.6
  Top 0.305: IC4.15 53.98,76.83 55.88,74.93
ADR5
  Top 0.254: 56.52,75.56 62.87,75.56 64.61,73.82 79.38,73.82 80.64,75.09 IC6.7
  Top 0.305: IC4.14 55.24,76.83 56.52,75.56
ADR6
  Top 0.254: 57.47,76.2 63.18,76.2 64.93,74.45 78.58,74.45 79.38,75.25 IC6.8
  Top 0.305: IC4.13 56.52,77.15 57.47,76.2
ADR7
  Top 0.254: 58.1,76.83 63.5,76.83 65.25,75.09 77.47,75.09 78.11,75.72 IC6.9
  Top 0.305: IC4.12 57.78,77.15 58.1,76.83
ALE  (via drill 0.6 pad 1.27)
  Top 0.305: IC1.43 58.33,63.88 v59.21,64.77 | IC4.11 59.05,78.42 v59.21,78.26 | v59.21,78.26
  Bottom 0.305: v59.21,64.77 v59.21,78.26
ASR0
  Top 0.305: IC1.29 69.32,55.99 70.01,56.67 93.5,56.67 96.84,53.34 96.84,34.61 96.52,34.29 92.08,34.29 91.76,33.97 91.76,29.21 SPI_CON.2
ASR1
  Top 0.305: IC1.30 67.04,56.79 66.36,57.47 66.36,58.42 67.31,59.37 69.37,59.37 69.69,59.05 94.93,59.05 99.69,54.29 99.69,32.07 SPI_CON.1
ASR2
  Top 0.305: SPI_CON.4 94.3,31.75 96.52,31.75 97.79,33.02 97.79,53.66 93.86,57.59 IC1.31
ASR3
  Top 0.305: SPI_CON.3 96.52,30.48 98.74,32.7 98.74,53.98 94.33,58.39 IC1.32
ASR4  (via drill 0.6)
  Top 0.305: IC1.14 64.72,43.38 65.72,42.39 67.79,42.39 67.94,42.23 v86.36,42.23
  Bottom 0.305: v86.36,42.23 86.36,38.42 91.76,33.02 SPI_CON.6
ASR5  (via drill 0.6)
  Top 0.305: IC1.15 65.53,43.54 65.88,43.18 87.63,43.18 v87.95,42.86
  Bottom 0.305: v87.95,42.86 87.95,38.1 91.76,34.29 94.3,34.29 SPI_CON.5
ASR6  (via drill 0.6)
  Top 0.305: IC1.16 66.36,44.45 66.86,43.95 89.08,43.95 v89.22,43.81
  Bottom 0.305: v89.22,43.81 89.22,38.73 92.39,35.56 SPI_CON.8
ASR7  (via drill 0.6)
  Top 0.305: 67.47,46.35 67.5,46.39 IC1.17 69.82,46.39 70.8,47.31 71.44,47.31 72.07,46.67 87.63,46.67 88.27,47.31 89.85,47.31 90.49,46.67 v90.49,45.72
  Bottom 0.305: v90.49,45.72 90.49,38.73 92.39,36.83 94.3,36.83 SPI_CON.7
COMP_INPUT
  Top 0.61: R33.1 17.77,3.66 R34.1 14.92,6.82 STAB_IMP2.5
CPU_RST  (via drill 0.6)
  Top 0.305: IC1.20 59.58,48.79 v58.1,47.31
  Bottom 0.305: v58.1,47.31 56.2,47.31 50.48,52.7 44.13,52.7 42.55,50.8 36.83,50.8 35.88,51.75 35.88,58.42 | 39.05,58.42 JTAG_CON.6 35.88,58.42 | R1.1 35.73,58.59 35.88,58.74 36.2,58.42 35.88,58.42
D_A
  Top 0.305: IC7.6 39.37,6.67 38.42,5.71 37.09,5.71 X6.4
D_B
  Top 0.305: IC7.7 40.64,5.76 X6.5
ENC_CS
  Top 0.305: IC1.5 57.52,40.9 57.78,40.64 57.78,39.05 60.33,36.51 U1.9
GND  (via drill 0.6, 0.6 pad 1.27)
  Top 0.305: IC4.10 59.64,68.31 v60.33,67.63 | v68.58,77.63 69.06,77.63 69.22,77.47 | 75.56,69.22 76.2,69.85 85.72,69.85 | 85.72,69.85 87,68.58 | 57.15,50.96 57.15,49.37 54.97,47.19 IC1.63 50.2,47.19 49.37,46.35 | 57.15,50.96 57.15,53.66 55.62,55.19 IC1.53 47.37,55.19 v46.99,55.56 46.35,56.2 C4.1 | v59.53,50.96 60.1,50.39 IC1.22 72.45,50.39 72.45,50.38 C6.1 74.08,50.22 74.61,49.69 74.61,49.85 | 57.15,50.96 v56.52,50.96 | 74.61,49.85 74.61,49.9 | 61.59,30.8 57.78,30.8 | U1.21 | U1.21 61.59,30.8 | 61.59,30.8 62.87,30.8 | U1.22 62.87,30.8 | U1.11 | 57.78,30.8 U1.18 | 57.78,30.8 U1.11 | 62.87,30.8 69.22,30.8 | 69.22,30.8 U1.2 | 69.22,30.8 75.25,30.8 C3.- | 50.8,38.42 51.92,37.3 57.32,37.3 57.78,36.83 U1.11 | RJ45.10 46.35,16.83 46.35,15.56 | SPI_CON.18 92.08,49.21 87.31,49.21 v86.68,49.85 | 38.73,63.5 42.07,66.83 v46.99,66.83 47.62,67.47 IC4.1 47.62,69.85 45.94,71.54 C20.1 45.19,71.54 45.09,71.44 40.96,71.44 C22.- | 46.35,15.56 56.83,15.56 60.01,12.38 65.41,12.38 65.41,13.65 | C13.1 88.8,72.92 86.36,70.48 | 41.61,39.99 C21.- 41.61,40.94 41.59,40.96 41.27,40.64 | 50.8,38.42 R2.2 | 50.8,38.42 v50.8,42.23 | C5.1 49.37,46.51 49.21,46.35 v49.21,46.99 | 18.1,71.44 25.72,71.44 | 25.48,66.75 25.4,66.67 | 25.48,66.75 SD_CON.P$6 25.62,71.34 25.72,71.44 | 25.72,71.44 25.72,66.99 | 25.72,66.99 25.48,66.75 | 25.72,66.99 25.72,62.55 37.78,62.55 38.73,63.5 | 38.73,63.5 JTAG_CON.10 | B1.- 6.03,50.48 AC_CON.8 | 38.1,11.75 IC7.5 | 38.1,11.75 38.73,12.38 43.18,12.38 | 46.35,15.56 43.18,12.38 | 43.18,12.38 C9.1 | IC5.26 IC5.25 84.17,17.3 84.14,17.33 | U1.21 61.59,21.43 RJ45.7 62.39,19.05 65.09,19.05 | 65.09,19.05 v67.94,19.05 | 65.41,13.65 65.41,18.73 65.09,19.05
  Top 0.305: 84.14,17.33 C19.1 | 65.41,13.65 65.51,13.76 C11.2 67.63,13.12 67.63,9.21 69.22,7.62 71.44,7.62 72.82,9 USB_CON.4 78.81,9.06 C10.1 80.01,7.94 81.6,7.94 | 81.6,17.33 82.23,17.33 | 82.23,17.33 84.14,17.33 | 81.6,17.33 81.56,17.3 IC5.21 81.6,15.09 81.6,7.94 | IC5.7 82.22,17.35 82.23,17.33 | C19.1 89.03,18.1 | IC5.18 79.61,16.27 79.06,16.83 79.06,17.46 79.69,18.1 80.83,18.1 81.6,17.33 | 81.6,7.94 83.03,7.94 RU1.2 | C16.- 90.67,14.92 C19.1 | 38.1,11.75 35.24,14.61 INT_CON.10 INT_CON.9 | 74.61,49.85 v75.88,49.85 | C17.2 81.44,50.01 v81.28,49.85 C18.2 | I2C_CON.1 94.93,62.87 93.98,63.82 85.41,63.82 v84.77,63.18 | 85.72,69.85 86.36,70.48 | 86.36,70.48 v86.36,71.12
  Top 0.406: SD_CON.P$3 18.1,67.55 18.1,71.44 v18.1,76.2 | X4.1 1.27,38.58 0.16,37.47 0.16,34.45 1.11,33.5 X4.3 2.38,33.18 | 14.92,1.59 14.92,2.38 12.86,4.45 2.54,4.45 1.75,3.65 1.75,2.19 C29.2 | 24.61,27.43 C23.- | 24.64,22.83 24.61,22.86 | D2.A
  Top 0.61: R34.2 17.63,1.42 18.1,0.95 39.33,0.95 X6.6
  Top 0.813: 43.18,38.42 41.61,39.99 | 50.8,38.42 43.18,38.42 | 43.18,38.42 41.75,36.99 C15.- 39.69,33.97 IC2.1 | 41.27,40.64 v40.32,40.64 | STAB_IMP2.4 14.92,1.59 16.83,1.59 R34.2 | C25.- C24.- 2.38,33.18 | D2.A 18.1,22.86 24.61,22.86 24.61,27.43 | C27.- 24.64,22.83
  Bottom 0.305: 67.47,76.52 60.33,69.37 v60.33,67.63 60.33,63.98 59.69,63.34 58.58,63.34 55.09,66.83 47.94,66.83 | 67.47,76.52 | 67.47,76.52 v68.58,77.63 | v46.99,66.83 47.94,66.83 | v56.52,50.96 v59.53,50.96 59.27,50.7 C14.2 | C7.1 56.09,6.13 56.2,6.03 C8.1 56.2,3.81 61.59,3.81 61.61,3.83 RJ45.S1 | C7.1 51.44,3.81 45.4,3.81 45.42,3.83 RJ45.S2 | C7.1 49.74,6.13 49.53,6.35 49.53,8.26 48.26,9.53 46.35,9.53 46.04,9.84 46.04,20.32 RJ45.10 | SPI_CON.18 SPI_CON.16 SPI_CON.14 SPI_CON.12 SPI_CON.10 93.03,37.78 | v46.99,55.56 43.5,55.56 42.55,54.61 40.32,54.61 39.05,53.34 JTAG_CON.2 | v46.99,55.56 47.94,56.52 47.94,66.83 | v50.8,42.23 50.8,45.4 v49.21,46.99 | 4.76,66.99 3.49,68.26 | 4.76,56.83 4.76,51.12 4.13,50.48 AC_CON.8 | 4.76,56.83 4.76,66.99 | 3.49,68.26 AC_CON.1 | 3.49,68.26 11.43,76.2 15.24,76.2 | C2.2 v67.94,19.05 C1.2 | v75.88,49.85 v81.28,49.85 v86.68,49.85 | 55.88,54.61 v60.33,54.61 | 55.88,54.61 v55.24,53.98 | 55.88,54.61 47.94,54.61 v46.99,55.56 | v86.36,71.12 86.36,64.77 v84.77,63.18 | 4.76,66.99 5.4,66.99 6.35,66.04 6.35,64.77 v10.16,64.77 | R10.1 4.93,57 4.76,56.83
  Bottom 0.406: 18.1,76.35 R18.1 15.24,76.2 | 18.1,76.35 R17.1 | R17.1 23.18,76.52 | R17.1 R16.1 28.26,76.2 | 18.1,76.35 18.1,76.52 | 18.1,76.35 v18.1,76.2 | 24.64,19.02 C27.- | X4.1
  Bottom 0.61: X6.6 45.38,3.71 RJ45.S2 | 24.64,19.02 29.21,14.61 INT_CON.9
  Bottom 0.813: X4.1 5.87,42.39 5.87,46.83 B1.- | X4.1
  other vias: 62.55,30.48 69.85,38.1 90.49,68.9
  pour Top (isolate 0.406): 0,80.01 0,0 100.01,0 100.01,80.01
  pour Bottom (isolate 0.406): 0,80.01 0,0 100.01,0 100.01,80.01
INT4  (via drill 0.6)
  Top 0.305: IC1.6 58.33,41.05 v59.05,40.32
  Bottom 0.305: v59.05,40.32 57.15,42.23 53.02,42.23 41.91,31.11 34.92,31.11 31.11,27.3 INT_CON.1
INT5  (via drill 0.6)
  Top 0.305: IC1.7 59.12,41.84 60.33,40.64 60.33,39.69 v59.69,39.05
  Bottom 0.305: v59.69,39.05 58.74,39.05 57.78,40.01 57.78,40.32 56.83,41.27 53.34,41.27 41.91,29.84 36.2,29.84 33.66,27.3 INT_CON.2
INT6  (via drill 0.6)
  Top 0.305: v60.64,37.78 61.28,38.42 61.28,40.64 59.92,41.99 IC1.8 | v31.75,9.53 31.75,3.87 X6.3
  Bottom 0.305: v60.64,37.78 58.1,37.78 57.15,38.73 57.15,40.01 56.83,40.32 53.66,40.32 39.69,26.35 39.69,22.23 | 39.69,22.23 39.69,20.64 37.47,18.41 37.47,11.43 35.56,9.53 v31.75,9.53 | 39.69,22.23 INT_CON.4
MISO  (via drill 0.6)
  Top 0.305: v64.14,39.05 U1.6 | SPI_CON.11 94.3,41.91 92.08,41.91 91.44,41.27 v66.67,41.27 65.88,41.27 63.92,43.23 IC1.13 63.92,44.02
  Bottom 0.305: v64.14,39.05 66.36,41.27 v66.67,41.27 66.67,44.13 63.5,47.31 60.64,47.31 59.37,46.04 54.61,46.04 51.44,49.21 31.11,49.21 28.26,52.07 R13.1
MOSI  (via drill 0.6)
  Top 0.305: 64.61,41.43 63.18,42.86 63.18,44.45 63.12,44.51 IC1.12 63.12,42.28 v63.5,41.91 | 64.61,41.43 66.04,40.01 91.44,40.01 92.08,39.37 94.3,39.37 SPI_CON.9 | 64.61,41.43 64.29,41.12 62.87,39.69 U1.7
  Bottom 0.305: v63.5,41.91 61.91,43.5 54.61,43.5 50.16,47.94 24.77,47.94 22.54,50.16 22.54,56.2 18.57,60.17 R14.1
N$1  (via drill 0.6)
  Top 0.305: v12.7,64.77 12.7,66.07 SD_CON.P$1
  Bottom 0.305: R10.2 R9.1 12.06,62.23 12.7,62.87 v12.7,64.77
N$2
  Top 0.305: IC1.54 45.62,54.39 43.5,56.52 43.5,61.59 41.59,63.5 JTAG_CON.9
N$3
  Top 0.305: IC1.56 44.37,52.79 42.55,54.61 40.64,54.61 40.01,55.24 40.01,57.15 41.27,58.42 JTAG_CON.5
N$4
  Top 0.305: U1.24 65.41,24.45 66.99,22.86 68.77,22.86 Q1.2
  Bottom 0.305: C2.1 71.02,20.61 Q1.2
N$5
  Top 0.305: IC1.55 44.84,53.59 42.55,55.88 JTAG_CON.3
N$6
  Top 0.305: IC1.57 42.79,51.99 JTAG_CON.1
N$7
  Top 0.305: 76.2,53.82 | 76.2,53.82 Q2.1 | 77.47,53.82 77.47,53.66 77.73,53.6 C18.1 | 77.47,53.82 76.2,53.82 | IC1.23 70.71,51.19 73.34,53.82 77.47,53.82
N$8
  Top 0.305: IC1.24 70.24,51.99 73.5,55.24 81.92,55.24 83.19,54.13 85.48,54.09 | 85.48,54.09 Q2.2 | 84.77,53.98 84.51,53.71 C17.1 | 84.77,53.98 84.72,53.92 | 85.48,54.09 85.48,54.04 85.41,53.98 84.77,53.98
N$10  (via drill 0.6)
  Top 0.305: IC1.9 60.73,42.95 60.73,42.78 60.96,42.55 v61.28,42.23 | U1.4 v66.67,37.47
  Bottom 0.305: v61.28,42.23 62.87,40.64 62.87,38.42 63.5,37.78 66.36,37.78 v66.67,37.47
N$13
  Top 0.305: USB_CON.2 70.32,11.58 71.44,12.7 77.47,12.7 78.31,13.54 IC5.16
N$14
  Top 0.305: IC5.15 77.67,14.16 77.15,13.65 70.48,13.65 68.9,12.06 68.9,10.48 USB_CON.3
N$15
  Top 0.305: C10.2 79.16,11.33 78.97,11.52 IC5.17
N$18
  Top 0.305: U1.23 64.14,22.54 Q1.1
  Bottom 0.305: C1.1 64.87,20.61 Q1.1
N$19
  Top 0.305: U1.14 53.81,35.41 R2.1
N$20
  Bottom 0.305: RJ45.9 50.48,22.23 R7.2
N$22
  Top 0.813: JP1.2 22.54,13.02 22.2,12.57 L4.2
N$23
  Bottom 0.305: RJ45.8 58.1,20.64 58.59,21.12 R8.2
N$24  (via drill 0.6)
  Top 0.305: RJ45.5 50.53,31.16 v51.44,32.07 | v56.2,32.38 56.52,32.7 U1.12
  Bottom 0.305: v51.44,32.07 55.88,32.07 v56.2,32.38 | R3.1 49.85,15.88 50.48,16.51 50.48,18.1 50.53,18.15 RJ45.5
N$25  (via drill 0.6)
  Top 0.61: L3.1 v68.26,15.88 67.41,15.88 67.36,15.82 C11.1
  Bottom 0.305: USB_CON.1 72.82,11.32 v68.26,15.88
N$26  (via drill 0.6)
  Top 0.305: L3.2 73.98,15.88 JP2.2 | v86.04,8.26 RU2.1
  Bottom 0.305: JP2.2 75.25,16.19 83.5,7.94 85.72,7.94 v86.04,8.26
N$27
  Top 0.305: U1.13 55.24,33.66 52.39,30.8 52.39,18.1 52.47,18.18 RJ45.4
  Bottom 0.305: R4.1 53.02,15.56 52.56,16.02 RJ45.4
N$28  (via drill 0.6)
  Top 0.305: 84.14,10.63 RU1.1 | 84.14,10.63 RU2.2 | IC5.19 80.27,13.08 v80.33,13.02 | v84.45,11.11 84.45,10.95 84.14,10.63
  Bottom 0.305: v80.33,13.02 82.23,11.11 v84.45,11.11
N$29
  Top 0.305: RJ45.3 54.59,18.12 54.61,18.1 55.24,18.73 U1.16
  Bottom 0.305: R6.1 56.2,13.97 54.59,15.58 RJ45.3
N$30
  Top 0.305: IC5.12 78.97,23.4 79.69,24.13 81.92,24.13 83.19,25.4 84.61,25.4 RL5.1
N$31
  Top 0.305: RJ45.2 56.59,18.18 56.52,18.1 U1.17
  Bottom 0.305: R5.1 59.69,13.97 56.62,17.04 RJ45.2
N$32
  Bottom 0.305: R3.2 49.85,10.79 50.01,10.96 51.44,10.96 | 51.44,10.96 R4.2 | 51.44,10.96 51.44,11.11 | C7.2 51.44,10.96
N$33
  Top 0.305: IC1.4 56.73,40.43 57.15,40.01 57.15,38.73 59.05,36.83 U1.10
N$34
  Top 0.305: U1.1 70.48,34.29 71.12,33.66 75.25,33.66 C3.+
N$35
  Bottom 0.305: C8.2 R6.2 59.54,10.96 59.69,11.11 R5.2 61.28,10.96 | L1.1 63.18,10.79 63.02,10.96 61.28,10.96 | RJ45.1 61.28,15.56 61.28,10.96
N$36  (via drill 0.6)
  Top 0.305: U1.26 v67.94,27.62
  Bottom 0.305: R7.1 67.14,26.82 v67.94,27.62
N$37  (via drill 0.6)
  Top 0.305: U1.27
  Bottom 0.305: R8.1 66.67,23.5 U1.27
  other vias: 69.22,26.04
N$38
  Top 0.305: IC5.14 77.67,24.17 RL4.1
N$39
  Top 0.305: IC5.13 78.31,23.7 79.69,25.08 81.43,25.08 RL3.1
N$40
  Top 0.305: IC5.22 82.22,13.04 82.87,12.38 87.15,12.38 RL2.1
N$41
  Top 0.305: IC5.23 82.86,13.65 83.19,13.34 89.05,13.34 RL1.1
N$45  (via drill 0.6)
  Top 0.305: IC1.62 54.34,47.99 v55.88,49.53
  Bottom 0.305: C14.1 57.47,49.21 57.15,49.53 v55.88,49.53
N$48
  Top 0.305: RL5.2 86.04,31.95 LED5.C
N$49
  Top 0.305: RL4.2 80.33,32.59 LED4.C
N$50
  Top 0.305: RL3.2 83.19,32.59 LED3.C
N$51
  Top 0.305: RL2.2 88.9,7.1 LED2.C
N$52
  Top 0.305: RL1.2 91.76,5.19 LED1.C
N$59
  Top 0.406: L5.P$2
  Top 0.813: L5.P$2 D2.C
  Bottom 0.406: L5.P$2 | 11.11,14.61
  Bottom 0.61: L5.P$2 11.11,14.61 11.11,5.08 9.84,3.81 STAB_IMP2.2
N$63
  Top 0.406: R33.2 21.11,8.92 L4.1 | L5.P$1 15.56,15.27 17.3,15.24 | 21.08,19.02 C27.+
  Top 0.813: L4.1 19.82,9.24 18.57,10.48 18.57,13.97 17.3,15.24 | 17.3,15.24 L5.P$1 | 17.3,15.24 21.08,19.02
N$66
  Top 0.406: STAB_IMP2.3 12.38,2.7 11.59,3.49 5.84,3.49 C29.1
N$68
  Top 0.61: STAB_IMP2.8 STAB_IMP2.7
  Top 0.813: STAB_IMP2.8 4.13,12.06 R32.1
  Bottom 0.61: STAB_IMP2.1 STAB_IMP2.8
RD  (via drill 0.6 pad 1.27)
  Top 0.254: v78.11,68.74 IC6.24
  Top 0.305: IC1.34 65.53,61.08 66.04,61.59 70.64,61.59 v71.12,61.12
  Bottom 0.254: 71.12,61.75 v78.11,68.74
  Bottom 0.305: v71.12,61.12 71.12,61.75
RX0  (via drill 0.6)
  Top 0.305: IC1.2 55.12,38.62 v54.93,38.42 | IC7.1 v41.91,20
  Bottom 0.305: 55.24,38.42 v54.93,38.42 54.61,38.42 41.91,25.72 v41.91,20
RX1  (via drill 0.6)
  Top 0.305: IC1.27 69.75,54.39 v70.17,53.98 | IC5.1 86.11,24.06 v85.72,24.45 | v83.19,38.73 v73.34,38.73
  Bottom 0.305: v70.17,53.98 73.34,50.48 v73.34,38.73 | v85.72,24.45 85.72,36.2 v83.19,38.73
SCK  (via drill 0.6)
  Top 0.305: U1.8 61.59,36.83 62.33,37.56 IC1.11 62.33,45.81 62.55,46.04 63.18,46.04 | 63.18,46.04 66.67,46.04 67.94,44.77 89.85,44.77 90.17,44.45 94.3,44.45 SPI_CON.13 | v63.18,46.35 63.18,46.04
  Bottom 0.305: v63.18,46.35 62.87,46.35 61.59,45.09 54.29,45.09 50.8,48.58 25.08,48.58 23.18,50.48 R15.1
SCL  (via drill 0.6)
  Top 0.305: IC1.25 66.44,52.79 v66.04,52.39
  Bottom 0.305: v66.04,52.39 70.17,56.52 83.82,56.52 92.71,65.41 I2C_CON.2
SD_CLK  (via drill 0.6)
  Top 0.406: 23.18,66.75 v23.18,68.58 | 23.18,66.75 SD_CON.P$5 | v23.18,64.77 23.18,66.75
  Bottom 0.406: v23.18,68.58 R17.2 | R15.2 v23.18,64.77
SD_CS  (via drill 0.6)
  Top 0.305: IC1.18 66.8,47.19 v66.67,47.31 | v36.83,53.02 20.64,53.02 v17.78,55.88
  Bottom 0.305: v66.67,47.31 61.91,52.07 52.39,52.07 50.8,53.66 43.81,53.66 41.91,51.75 38.1,51.75 v36.83,53.02 | R9.2 16.36,57 v17.78,55.88
SD_MISO  (via drill 0.6)
  Top 0.406: v28.26,64.77 28.26,66.67 | 28.26,66.67 28.26,66.75 SD_CON.P$7 | 28.26,66.67 v28.26,68.58
  Bottom 0.406: R13.2 v28.26,64.77 | v28.26,68.58 R16.2
SD_MOSI  (via drill 0.6)
  Top 0.406: v15.24,64.77 15.24,66.75 | 15.24,66.75 SD_CON.P$2 | 15.24,66.75 v15.24,68.58
  Bottom 0.406: R14.2 v15.24,64.77 | v15.24,68.58 R18.2
SDA  (via drill 0.6)
  Top 0.305: IC1.26 66.43,53.59 v66.04,53.98
  Bottom 0.305: v66.04,53.98 69.53,57.47 83.19,57.47 93.66,67.94 I2C_CON.3
SL_RST  (via drill 0.6)
  Top 0.305: IC1.10 61.52,46.28 63.18,47.94 64.14,47.94 v64.45,47.62 | v71.12,46.04 71.12,45.72 88.58,45.72 v88.9,46.04
  Bottom 0.305: v64.45,47.62 66.36,45.72 71.12,45.72 v71.12,46.04 | v88.9,46.04 93.03,50.16 SPI_CON.20
TX0  (via drill 0.6)
  Top 0.305: IC1.3 55.92,39.64 v56.2,39.37 | IC7.4 38.1,17.78 38.73,18.41 40.32,18.41 v40.64,18.73
  Bottom 0.305: v56.2,39.37 53.98,39.37 40.64,26.04 v40.64,18.73
TX1  (via drill 0.6)
  Top 0.305: IC1.28 69.79,55.19 69.85,55.24 v71.12,55.24 | IC5.5 83.52,24.12 v83.5,24.13
  Bottom 0.305: v71.12,55.24 71.75,54.61 71.75,53.34 74.3,50.8 74.3,38.1 74.61,37.78 82.55,37.78 84.45,35.88 84.45,27.94 83.5,26.99 v83.5,24.13
VCC  (via drill 0.6)
  Top 0.305: 88.37,67.36 88.42,67.31 88.27,67.15 IC6.32 | 58.1,49.37 58.32,49.59 | 72.13,48.52 71.97,48.52 70.9,49.59 IC1.21 | 72.13,48.52 72.07,48.58 | 72.13,48.52 C6.2 | 72.71,47.94 72.13,48.52 | C4.2 46.35,59.05 v46.35,60.33 | 45.62,73.24 C20.2 | 46.99,40.96 48.26,40.96 | IC4.20 47.62,78.11 47.47,77.95 | AC_CON.2 3.81,65.72 7.62,69.53 7.62,75.56 10.79,78.74 40.96,78.74 C22.+ | 46.99,40.96 47.01,40.94 C21.+ | 46.99,40.96 46.2,40.96 46.04,40.96 | C9.2 42.23,9.95 IC7.8 41.91,9.84 v42.55,9.84 | IC5.4 84.17,20.93 84.77,20.32 | 88.08,20.32 C19.2 88.9,20.13 89.22,20.45 | IC5.20 80.92,16.56 v80.33,17.14 | 94.48,20.13 C16.+ | LED5.A LED3.A LED4.A | LED2.A 88.47,1.48 v88.58,1.59
  Top 0.406: IC1.21 58.32,49.59 | 46.35,59.05 49.42,55.99 IC1.52 55.93,55.99 58.1,53.82 58.1,49.37 55.12,46.39 54.33,46.39 51.44,43.5 | C13.2 90.81,71.12 | 21.11,27.5 C23.+ | L2.2 43.37,45.22 | 46.04,41.12 46.2,40.96
  Top 0.61: 88.27,64.93 86.04,64.93 85.72,65.25 IC6.30 | 88.27,64.93 IC6.32 88.27,69.53 89.95,71.22 C13.2 | SPI_CON.15 95.57,46.99 | SPI_CON.19 SPI_CON.17 95.57,46.99 | 87.31,47.94 87.63,48.26 90.96,48.26 92.23,46.99 95.57,46.99 | 47.62,78.11 v47.62,75.25 45.62,73.24 | 97.79,66.67 91.44,66.67 89.69,64.93 88.27,64.93 | 48.26,40.96 48.26,42.23 49.53,43.5 51.44,43.5 | 47.47,77.95 C22.+ | v97.79,60.33 98.42,60.96 98.42,66.04 97.79,66.67 | 90.81,71.12 91.44,70.48 I2C_CON.4 97.79,70.48 97.95,70.33 | X6.2 27.94,3.86 | 27.94,10.48 27.46,10.48 | 88.08,20.32 84.77,20.32 v84.14,19.68 | 88.9,20.13 94.48,20.13 | 27.94,16.83 28.26,17.14 | LED5.A 88.47,36.31 89.22,35.56 89.22,20.45 | LED2.A LED1.A | v88.58,1.59 80.01,1.59 78.26,3.33 65.56,3.33 63.02,5.87 63.02,8.89 62.07,9.84 v42.55,9.84 | 97.79,66.67 98.42,67.31 98.42,69.85 97.95,70.33 | 97.95,70.33
  Top 0.813: 27.94,3.86 v27.94,7.62 27.94,10.48 27.94,16.83 27.94,28.73 26.83,29.84 22.07,29.84 21.11,28.89 21.11,27.5 | 27.46,10.48 JP1.1 | 28.26,17.14 INT_CON.7 INT_CON.8 | IC2.3 37.47,44.29 39.53,46.35 L2.2 | 43.37,45.22 46.04,42.55 46.04,41.12
  Top 1.016: 87.31,47.94 72.71,47.94
  Bottom 0.305: JTAG_CON.4 39.05,55.88 40.01,56.83 40.01,59.69 41.27,60.96 JTAG_CON.7 41.59,60.96 40.32,62.23 37.15,62.23 36.35,61.43 R1.2 | 80.33,17.78 v80.33,17.14 | 80.33,17.78 82.23,19.68 v84.14,19.68 | JP2.1 78.42,19.68 80.33,17.78
  Bottom 0.406: C23.+ 21.11,27.5
  Bottom 0.61: v46.35,60.33 45.72,60.96 43.5,60.96 | 43.5,60.96 41.59,60.96 | 43.5,60.96 43.5,71.12 v47.62,75.25 | SPI_CON.19 95.57,58.1 v97.79,60.33 | SPI_CON.15 97.79,43.5 97.79,23.5 C16.+ | v42.55,9.84 42.55,7.62 v27.94,7.62 | v88.58,1.59 88.58,15.24 v84.14,19.68
  Bottom 0.813: X4.2 3.17,36.04 7.3,31.91 21.11,31.91 | IC2.3 34.45,41.27 33.5,40.32 33.5,32.7 32.7,31.91 21.11,31.91 | 21.11,27.5 21.11,31.91
WR
  Top 0.254: 66.5,60.15 66.67,60.33 69.85,60.33 70.31,59.87 71.78,59.87 73.5,61.59 80.8,61.59 84.45,65.25 IC6.29
  Top 0.305: IC1.33 66.36,60.01 66.5,59.87 66.5,60.15

### Text on the board
tPlace: address | external memory | latch | JTAG CON | SD | SPI Con | USB | converter | RS 485 Con | RJ45 | USB Con
tValues: VCC | SDA | SCA | GND
Document: 5V DC